# EasyEDA Pro project ProProject_Hauptplatine_ESP32.epro, schematic ESP32-Adapter_V110.sch

## Sheets
1 Adapter_38pin
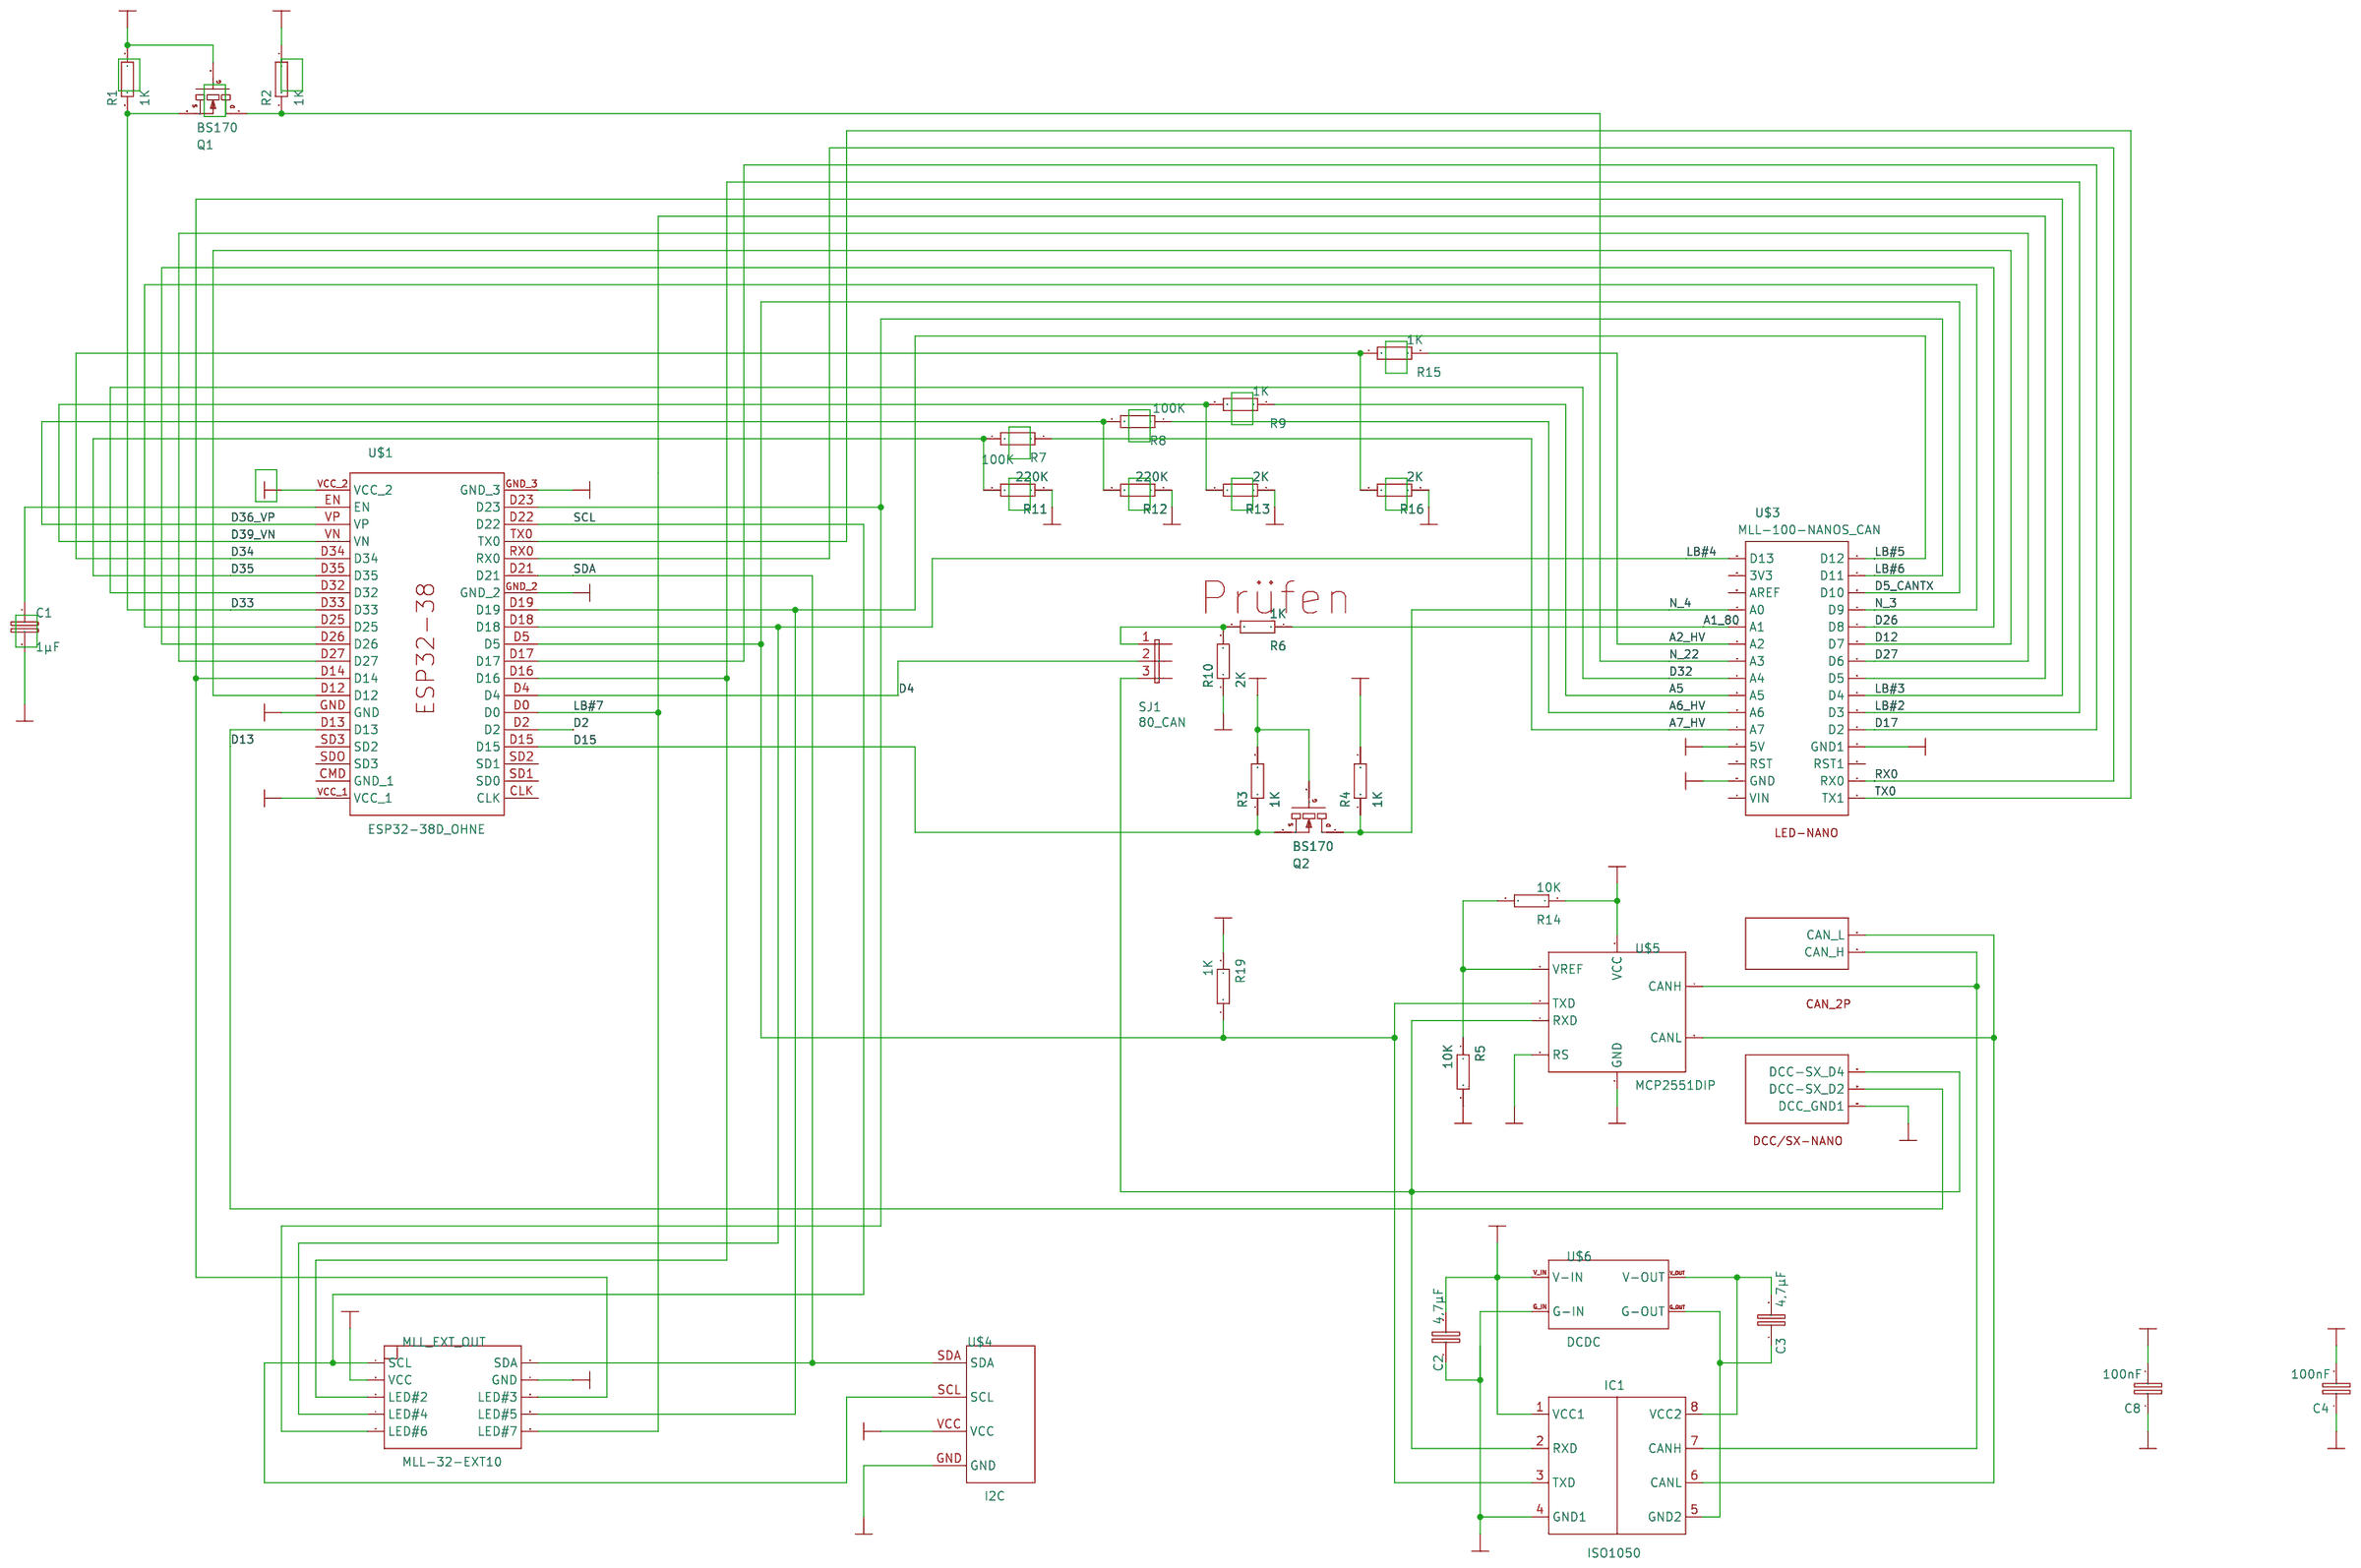
[diagram p0: Adapter_38pin]
2 Adapter_LEDs
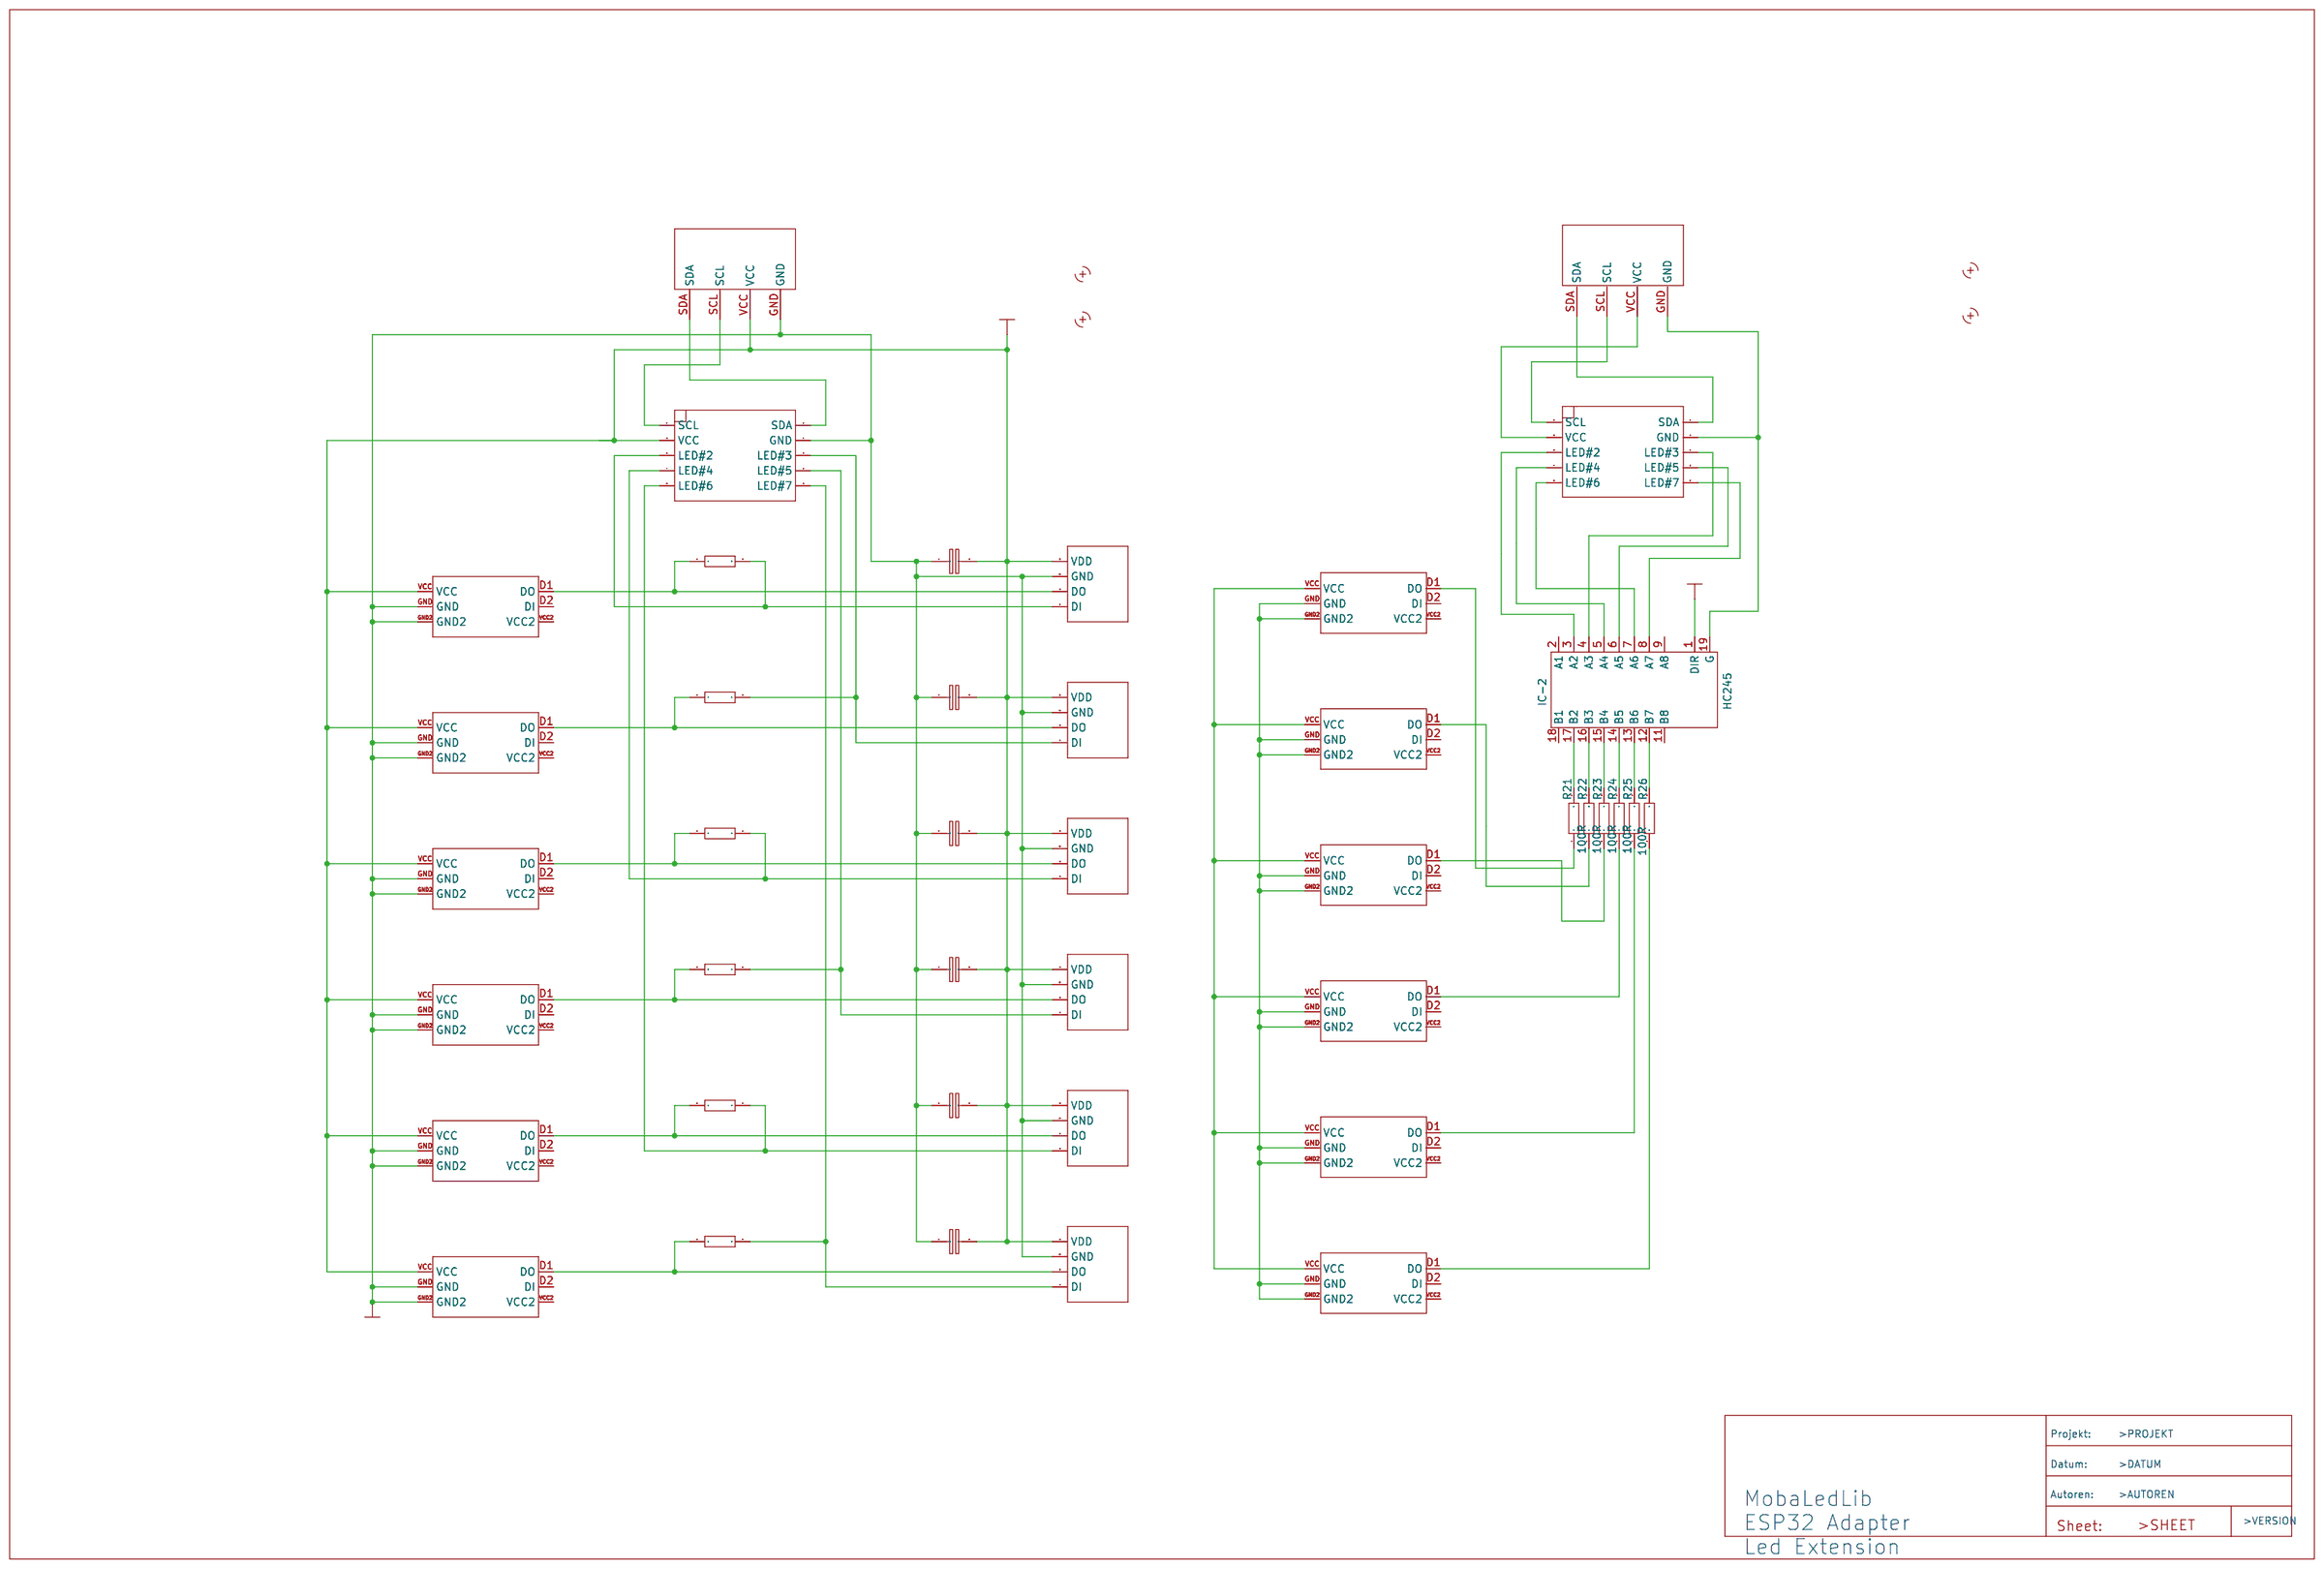
[diagram p1: Adapter_LEDs]
3 Adapter_V110
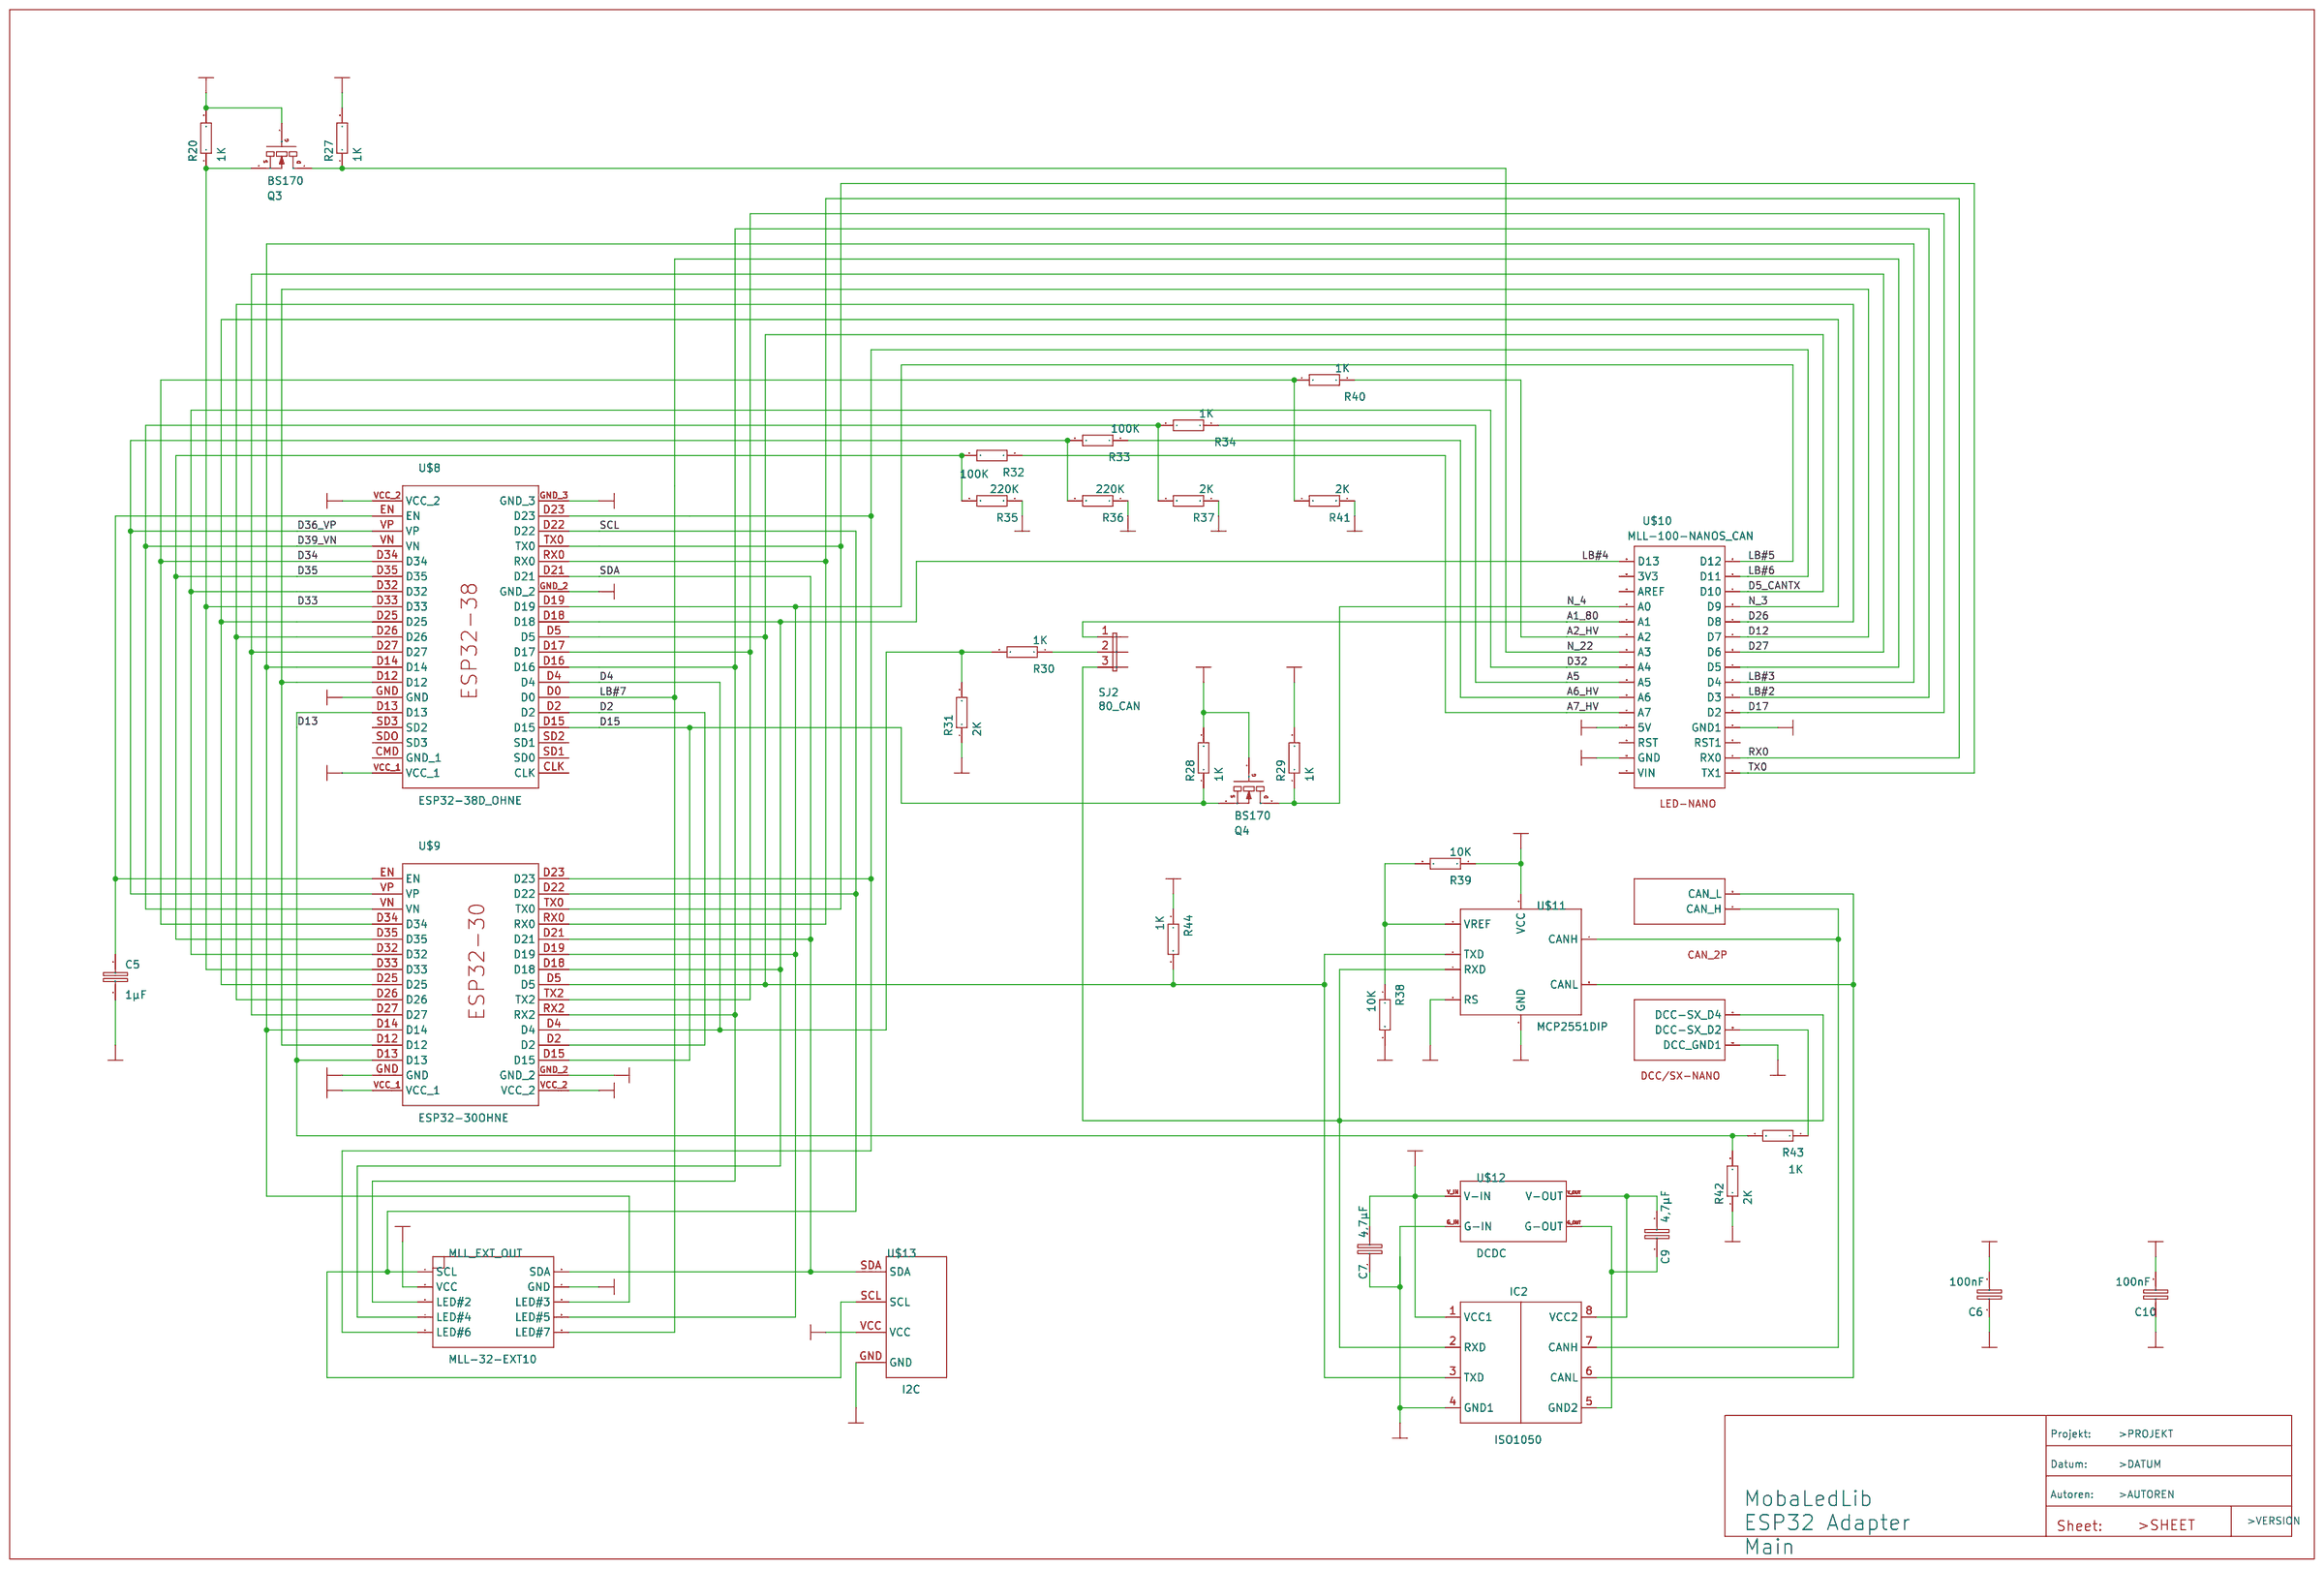
[diagram p2: Adapter_V110]

## Parts
sheet Adapter_38pin
C1  1µF
C2  4,7µF
C3  4,7µF
C4  100nF
C8  100nF
IC1  ISO1050
MLL_EXT_OUT  MLL-32-EXT10
Q1  BS170
Q2  BS170
R1  1K
R2  1K
R3  1K
R4  1K
R5  10K
R6  1K
R7  100K
R8  100K
R9  1K
R10  2K
R11  220K
R12  220K
R13  2K
R14  10K
R15  1K
R16  2K
R19  1K
SJ1  80_CAN
U$1  ESP32-38D_OHNE
U$3  MLL-100-NANOS_CAN
U$4  I2C
U$5  MCP2551DIP
U$6  DCDC
sheet Adapter_LEDs
CL2  100nF
CL3  100nF
CL4  100nF
CL5  100nF
CL6  100nF
CL7  100nF
FRAME2  MLL ESP32Adpapter AddOns
H1  MOUNT-HOLE2.8
H2  MOUNT-HOLE2.8
H3  MOUNT-HOLE2.8
H4  MOUNT-HOLE2.8
IC-2  HC245
LB2  WS2812-5050
LB3  WS2812-5050
LB4  WS2812-5050
LB5  WS2812-5050
LB6  WS2812-5050
LB7  WS2812-5050
LED_IN  MLL-32-EXT10
MLL_EXT_IN  MLL-32-EXT10
OUT2  LED-BUS-OUTPUT
OUT2A  LED-BUS-OUTPUT
OUT3  LED-BUS-OUTPUT
OUT3A  LED-BUS-OUTPUT
OUT4  LED-BUS-OUTPUT
OUT4A  LED-BUS-OUTPUT
OUT5  LED-BUS-OUTPUT
OUT5A  LED-BUS-OUTPUT
OUT6  LED-BUS-OUTPUT
OUT6A  LED-BUS-OUTPUT
OUT7  LED-BUS-OUTPUT
OUT7A  LED-BUS-OUTPUT
R21  100R
R22  100R
R23  100R
R24  100R
R25  100R
R26  100R
RL2  100R
RL3  100R
RL4  100R
RL5  100R
RL6  100R
RL7  100R
U$7  I2C
U$19  I2C
sheet Adapter_V110
C5  1µF
C6  100nF
C7  4,7µF
C9  4,7µF
C10  100nF
FRAME3  MLL ESP32 Adapter
IC2  ISO1050
MLL_EXT_OUT#2  MLL-32-EXT10
Q3  BS170
Q4  BS170
R20  1K
R27  1K
R28  1K
R29  1K
R30  1K
R31  2K
R32  100K
R33  100K
R34  1K
R35  220K
R36  220K
R37  2K
R38  10K
R39  10K
R40  1K
R41  2K
R42  2K
R43  1K
R44  1K
SJ2  80_CAN
U$8  ESP32-38D_OHNE
U$9  ESP32-30OHNE
U$10  MLL-100-NANOS_CAN
U$11  MCP2551DIP
U$12  DCDC
U$13  I2C

## Library data of the parts
C1 C5 = 1µF
C2 C3 C7 C9 = 4,7µF
C4 C6 C8 C10 CL2-CL7 = 100nF
IC1 IC2 = ISO1050
LED_IN MLL_EXT_IN MLL_EXT_OUT MLL_EXT_OUT#2 = MLL-32-EXT10
Q1-Q4 = BS170
R1-R4 R6 R9 R15 R19 R20 R27-R30 R34 R40 R43 R44 = 1K
R5 R14 R38 R39 = 10K
R7 R8 R32 R33 = 100K
R10 R13 R16 R31 R37 R41 R42 = 2K
R11 R12 R35 R36 = 220K
SJ1 SJ2 = 80_CAN
U$1 U$8 = ESP32-38D_OHNE
U$3 U$10 = MLL-100-NANOS_CAN
U$4 U$7 U$13 U$19 = I2C
U$5 U$11 = MCP2551DIP
U$6 U$12 = DCDC
FRAME2 = MLL ESP32Adpapter AddOns: DRAWING_NAME: &gt;DRAWING_NAME; LAST_DATE_TIME: &gt;LAST_DATE_TIME; SHEET: &gt;SHEET
H1-H4 = MOUNT-HOLE2.8
IC-2 = HC245
LB2-LB7 = WS2812-5050
OUT2 OUT2A OUT3 OUT3A OUT4 OUT4A OUT5 OUT5A OUT6 OUT6A OUT7 OUT7A = LED-BUS-OUTPUT
R21-R26 RL2-RL7 = 100R
FRAME3 = MLL ESP32 Adapter: DRAWING_NAME: &gt;DRAWING_NAME; LAST_DATE_TIME: &gt;LAST_DATE_TIME; SHEET: &gt;SHEET
U$9 = ESP32-30OHNE

## Nets
3V3: Q1.G Q2.G Q3.G Q4.G R1.2 R3.2 R19.1 R20.2 R28.2 R44.1 U$1.VCC_2 U$8.VCC_2 U$9.VCC_2
5V: C2.2 C4.2 C6.2 C7.2 C8.2 C10.2 CL2.2 CL3.2 CL4.2 CL5.2 CL6.2 CL7.2 IC1.1(VCC1) IC2.1(VCC1) IC-2.1(DIR) LB2.VCC(VDD) LB3.VCC(VDD) LB4.VCC(VDD) LB5.VCC(VDD) LB6.VCC(VDD) LB7.VCC(VDD) MLL_EXT_IN.3(VCC) MLL_EXT_OUT.3(VCC) MLL_EXT_OUT#2.3(VCC) OUT2.VCC OUT3.VCC OUT4.VCC OUT5.VCC OUT6.VCC OUT7.VCC R2.2 R4.2 R14.1 R27.2 R29.2 R39.1 U$1.VCC_1 U$3.5V U$4.VCC U$5.3(VCC) U$6.V_IN(V-IN) U$8.VCC_1 U$9.VCC_1 U$10.5V U$11.3(VCC) U$12.V_IN(V-IN) U$13.VCC U$19.VCC
GND: C1.2 C2.1 C4.1 C5.2 C6.1 C7.1 C8.1 C10.1 CL2.1 CL3.1 CL4.1 CL5.1 CL6.1 CL7.1 IC1.4(GND1) IC2.4(GND1) LB2.GND LB3.GND LB4.GND LB5.GND LB6.GND LB7.GND MLL_EXT_IN.4(GND) MLL_EXT_OUT.4(GND) MLL_EXT_OUT#2.4(GND) OUT2.GND OUT2.GND2 OUT3.GND OUT3.GND2 OUT4.GND OUT4.GND2 OUT5.GND OUT5.GND2 OUT6.GND OUT6.GND2 OUT7.GND OUT7.GND2 R5.2 R10.1 R11.1 R12.1 R13.1 R16.1 R31.1 R35.1 R36.1 R37.1 R38.2 R41.1 R42.1 U$1.GND U$1.GND_2 U$1.GND_3 U$3.DCC_GND1 U$3.GND U$3.GND1 U$4.GND U$5.2(GND) U$5.8(RS) U$6.G_IN(G-IN) U$8.GND U$8.GND_2 U$8.GND_3 U$9.GND U$9.GND_2 U$10.DCC_GND1 U$10.GND U$10.GND1 U$11.2(GND) U$11.8(RS) U$12.G_IN(G-IN) U$13.GND U$19.GND
A1_80: R6.1 SJ2.1 U$3.A1 U$10.A1
A2_HV: R15.1 R40.1 U$3.A2 U$10.A2
A5: R9.1 R34.1 U$3.A5 U$10.A5
A6_HV: R8.1 R33.1 U$3.A6 U$10.A6
A7_HV: R7.1 R32.1 U$3.A7 U$10.A7
D2: U$1.D2 U$8.D2 U$9.D2
D4: R30.2 R31.2 SJ1.2 U$1.D4 U$8.D4 U$9.D4
D5_CANTX: IC1.3(TXD) IC2.3(TXD) R19.2 R44.2 U$1.D5 U$3.D10 U$5.1(TXD) U$8.D5 U$9.D5 U$10.D10 U$11.1(TXD)
D12: U$1.D12 U$3.D7 U$8.D12 U$9.D12 U$10.D7
D13: R42.2 R43.2 U$1.D13 U$3.DCC_D2(DCC-SX_D2) U$8.D13 U$9.D13
D15: Q2.S Q4.S R3.1 R28.1 U$1.D15 U$8.D15 U$9.D15
D17: U$1.D17 U$3.D2 U$8.D17 U$9.TX2 U$10.D2
D26: U$1.D26 U$3.D8 U$8.D26 U$9.D26 U$10.D8
D27: U$1.D27 U$3.D6 U$8.D27 U$9.D27 U$10.D6
D32: U$1.D32 U$3.A4 U$8.D32 U$9.D32 U$10.A4
D33: Q1.S Q3.S R1.1 R20.1 U$1.D33 U$8.D33 U$9.D33
D34: R15.2 R16.2 R40.2 R41.2 U$1.D34 U$8.D34 U$9.D34
D35: R7.2 R11.2 R32.2 R35.2 U$1.D35 U$8.D35 U$9.D35
D36_VP: R8.2 R12.2 R33.2 R36.2 U$1.VP U$8.VP U$9.VP
D39_VN: R9.2 R13.2 R34.2 R37.2 U$1.VN U$8.VN U$9.VN
LB#2: MLL_EXT_OUT.5(LED#2) MLL_EXT_OUT#2.5(LED#2) U$1.D16 U$3.D3 U$8.D16 U$9.RX2 U$10.D3
LB#3: MLL_EXT_OUT.6(LED#3) MLL_EXT_OUT#2.6(LED#3) U$1.D14 U$3.D4 U$8.D14 U$9.D14 U$10.D4
LB#4: MLL_EXT_OUT.7(LED#4) MLL_EXT_OUT#2.7(LED#4) U$1.D18 U$3.D13 U$8.D18 U$9.D18 U$10.D13
LB#5: MLL_EXT_OUT.8(LED#5) MLL_EXT_OUT#2.8(LED#5) U$1.D19 U$3.D12 U$8.D19 U$9.D19 U$10.D12
LB#6: MLL_EXT_OUT.9(LED#6) MLL_EXT_OUT#2.9(LED#6) U$1.D23 U$3.D11 U$8.D23 U$9.D23 U$10.D11
LB#7: MLL_EXT_OUT.10(LED#7) MLL_EXT_OUT#2.10(LED#7) U$1.D0 U$3.D5 U$8.D0 U$10.D5
N_3: U$1.D25 U$3.D9 U$8.D25 U$9.D25 U$10.D9
N_4: Q2.D Q4.D R4.1 R29.1 U$3.A0 U$10.A0
N_22: Q1.D Q3.D R2.1 R27.1 U$3.A3 U$10.A3
RX0: U$1.RX0 U$3.RX0 U$8.RX0 U$9.RX0 U$10.RX0
SCL: MLL_EXT_OUT.1(SCL) MLL_EXT_OUT#2.1(SCL) U$1.D22 U$4.SCL U$8.D22 U$9.D22 U$13.SCL
SDA: MLL_EXT_OUT.2(SDA) MLL_EXT_OUT#2.2(SDA) U$1.D21 U$4.SDA U$8.D21 U$9.D21 U$13.SDA
TX0: U$1.TX0 U$3.TX1 U$8.TX0 U$9.TX0 U$10.TX1
Net-(C1-1): C1.1 U$1.EN
Net-(C3-1): C3.1 IC1.5(GND2) U$6.G_OUT(G-OUT)
Net-(C3-2): C3.2 IC1.8(VCC2) U$6.V_OUT(V-OUT)
Net-(C5-1): C5.1 U$8.EN U$9.EN
Net-(C9-1): C9.1 IC2.5(GND2) U$12.G_OUT(G-OUT)
Net-(C9-2): C9.2 IC2.8(VCC2) U$12.V_OUT(V-OUT)
Net-(IC1-2): IC1.2(RXD) SJ1.3 U$3.DCC_D4(DCC-SX_D4) U$5.4(RXD)
Net-(IC1-6): IC1.6(CANL) U$3.CAN_L U$5.6(CANL)
Net-(IC1-7): IC1.7(CANH) U$3.CAN_H U$5.7(CANH)
Net-(IC2-2): IC2.2(RXD) SJ2.3 U$10.DCC_D4(DCC-SX_D4) U$11.4(RXD)
Net-(IC2-6): IC2.6(CANL) U$10.CAN_L U$11.6(CANL)
Net-(IC2-7): IC2.7(CANH) U$10.CAN_H U$11.7(CANH)
Net-(IC-2-3): IC-2.3(A2) LED_IN.5(LED#2)
Net-(IC-2-4): IC-2.4(A3) LED_IN.6(LED#3)
Net-(IC-2-5): IC-2.5(A4) LED_IN.7(LED#4)
Net-(IC-2-6): IC-2.6(A5) LED_IN.8(LED#5)
Net-(IC-2-7): IC-2.7(A6) LED_IN.9(LED#6)
Net-(IC-2-8): IC-2.8(A7) LED_IN.10(LED#7)
Net-(IC-2-12): IC-2.12(B7) R26.2
Net-(IC-2-13): IC-2.13(B6) R25.2
Net-(IC-2-14): IC-2.14(B5) R24.2
Net-(IC-2-15): IC-2.15(B4) R23.2
Net-(IC-2-16): IC-2.16(B3) R22.2
Net-(IC-2-17): IC-2.17(B2) R21.2
Net-(IC-2-19): IC-2.19(G) LED_IN.4(GND) U$7.GND
Net-(LB2-DI): LB2.DI MLL_EXT_IN.5(LED#2) RL2.2
Net-(LB2-DO): LB2.DO OUT2.D1(DO) RL2.1
Net-(LB3-DI): LB3.DI MLL_EXT_IN.6(LED#3) RL3.2
Net-(LB3-DO): LB3.DO OUT3.D1(DO) RL3.1
Net-(LB4-DI): LB4.DI MLL_EXT_IN.7(LED#4) RL4.2
Net-(LB4-DO): LB4.DO OUT4.D1(DO) RL4.1
Net-(LB5-DI): LB5.DI MLL_EXT_IN.8(LED#5) RL5.2
Net-(LB5-DO): LB5.DO OUT5.D1(DO) RL5.1
Net-(LB6-DI): LB6.DI MLL_EXT_IN.9(LED#6) RL6.2
Net-(LB6-DO): LB6.DO OUT6.D1(DO) RL6.1
Net-(LB7-DI): LB7.DI MLL_EXT_IN.10(LED#7) RL7.2
Net-(LB7-DO): LB7.DO OUT7.D1(DO) RL7.1
Net-(LED_IN-1): LED_IN.1(SCL) U$7.SCL
Net-(LED_IN-2): LED_IN.2(SDA) U$7.SDA
Net-(LED_IN-3): LED_IN.3(VCC) U$7.VCC
Net-(MLL_EXT_IN-1): MLL_EXT_IN.1(SCL) U$19.SCL
Net-(MLL_EXT_IN-2): MLL_EXT_IN.2(SDA) U$19.SDA
Net-(OUT2A-D1): OUT2A.D1(DO) R21.1
Net-(OUT2A-GND): OUT2A.GND OUT2A.GND2 OUT3A.GND OUT3A.GND2 OUT4A.GND OUT4A.GND2 OUT5A.GND OUT5A.GND2 OUT6A.GND OUT6A.GND2 OUT7A.GND OUT7A.GND2
Net-(OUT2A-VCC): OUT2A.VCC OUT3A.VCC OUT4A.VCC OUT5A.VCC OUT6A.VCC OUT7A.VCC
Net-(OUT3A-D1): OUT3A.D1(DO) R22.1
Net-(OUT4A-D1): OUT4A.D1(DO) R23.1
Net-(OUT5A-D1): OUT5A.D1(DO) R24.1
Net-(OUT6A-D1): OUT6A.D1(DO) R25.1
Net-(OUT7A-D1): OUT7A.D1(DO) R26.1
Net-(R5-1): R5.1 R14.2 U$5.5(VREF)
Net-(R6-2): R6.2 R10.2 SJ1.1
Net-(R30-1): R30.1 SJ2.2
Net-(R38-1): R38.1 R39.2 U$11.5(VREF)
Net-(R43-1): R43.1 U$10.DCC_D2(DCC-SX_D2)

Not connected (* = marked no-connect by the designer): IC-2 2(A1) 9(A8) 11(B8) 18(B1); OUT2 D2(DI) VCC2; OUT2A D2(DI) VCC2; OUT3 D2(DI) VCC2; OUT3A D2(DI) VCC2; OUT4 D2(DI) VCC2; OUT4A D2(DI) VCC2; OUT5 D2(DI) VCC2; OUT5A D2(DI) VCC2; OUT6 D2(DI) VCC2; OUT6A D2(DI) VCC2; OUT7 D2(DI) VCC2; OUT7A D2(DI) VCC2; U$1 CLK CMD(GND_1) SD1(SD0) SD2(SD1) SD3(SD2) SDO(SD3); U$3 3V3 AREF RST RST1 VIN; U$8 CLK CMD(GND_1) SD1(SD0) SD2(SD1) SD3(SD2) SDO(SD3); U$10 3V3 AREF RST RST1 VIN

## Notes on the sheets
sheet 1
- ✓
- ✓
- ✓
- ✓
- ✓
- ✓
- ✓
- ✓
- ✓
- ✓
- ✓
- ✓
- Prüfen
- ✓
sheet 2
- Projekt:
- >PROJEKT
- Datum:
- >DATUM
- MobaLedLib
  ESP32 Adapter
  Led Extension
- Autoren:
- >AUTOREN
- >VERSION
sheet 3
- Projekt:
- >PROJEKT
- Datum:
- >DATUM
- MobaLedLib
  ESP32 Adapter
  Main
- MobaLedLib
  ESP32 Adapter
  Main
- Autoren:
- >AUTOREN
- >VERSION
